# Altium schematic sheet 19-CPLD.SchDoc
size A4
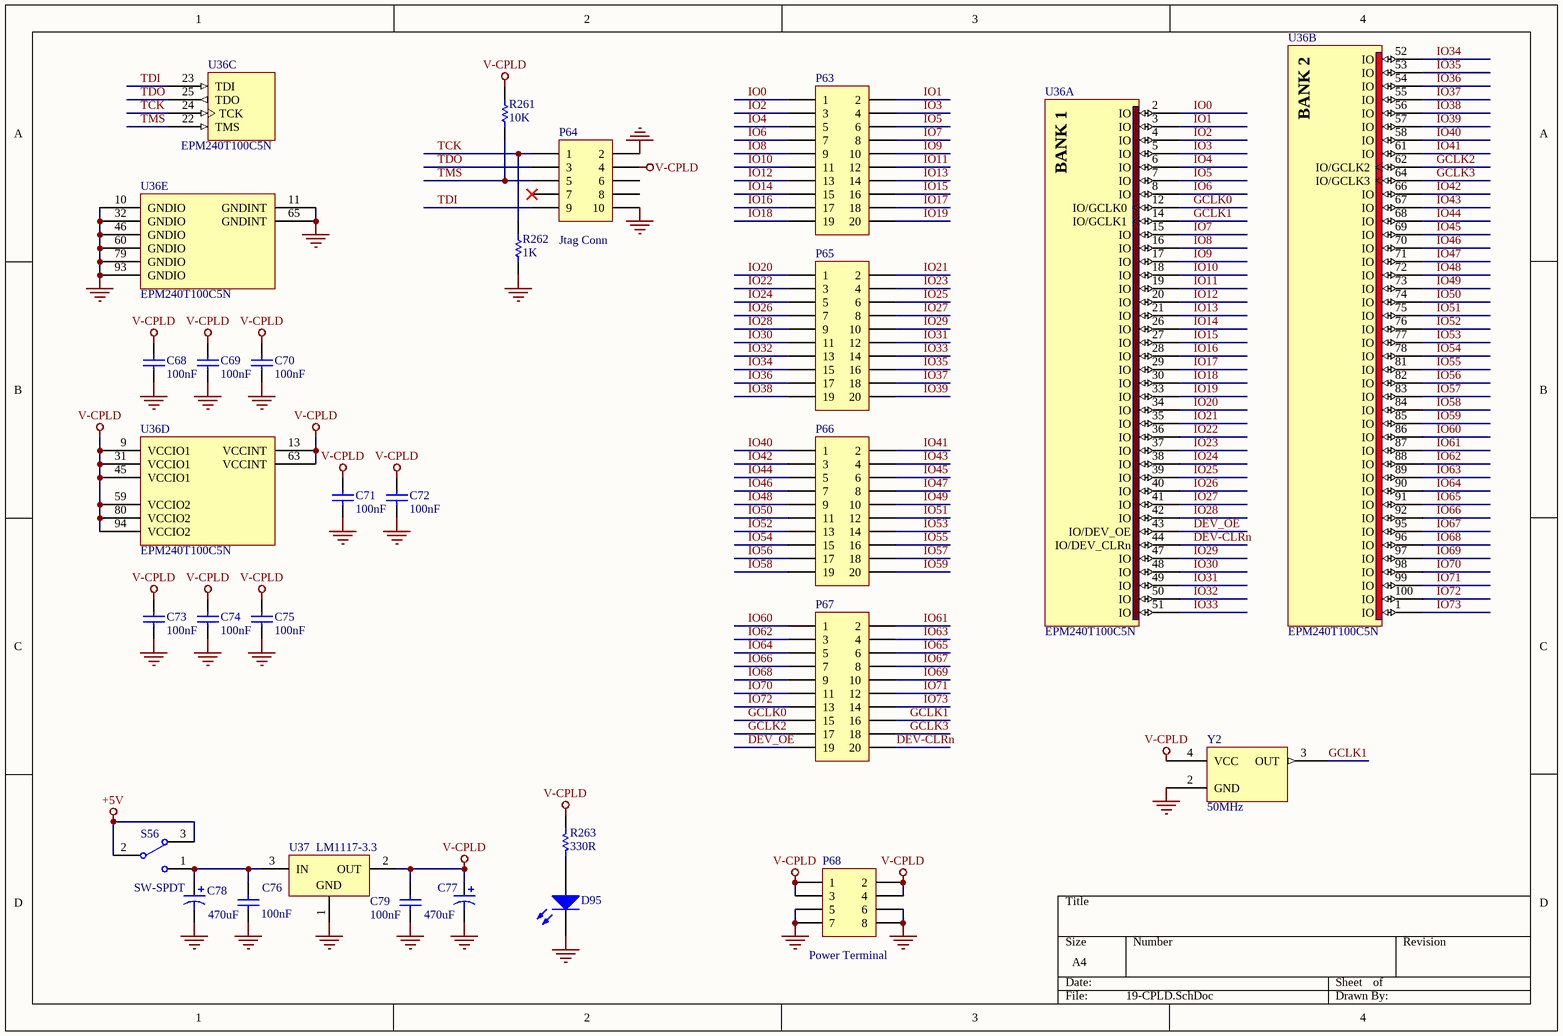
[diagram p0: 19-CPLD.SchDoc]

## Parts
C68  value 100nF  [c-0805]  (hidden comment: 104)
C69  value 100nF  [c-0805]  (hidden comment: 104)
C70  value 100nF  [c-0805]  (hidden comment: 104)
C71  value 100nF  [c-0805]  (hidden comment: 104)
C72  value 100nF  [c-0805]  (hidden comment: 104)
C73  value 100nF  [c-0805]  (hidden comment: 104)
C74  value 100nF  [c-0805]  (hidden comment: 104)
C75  value 100nF  [c-0805]  (hidden comment: 104)
C76  value 100nF  [c-0805]  (hidden comment: 104)
C77  value 470uF  [C-ALU-10x10mm]  (hidden comment: 470uF/16V)
C78  value 470uF  [C-ALU-10x10mm]  (hidden comment: 470uF/16V)
C79  value 100nF  [c-0805]  (hidden comment: 104)
D95  LED  [LED-3528]  (value not drawn)
P63  H2  [HDR2X10]  (value not drawn)
P64  value Jtag Conn  [HDR2X5]  (hidden comment: IDE5x2)
P65  H2  [HDR2X10]  (value not drawn)
P66  H2  [HDR2X10]  (value not drawn)
P67  H2  [HDR2X10]  (value not drawn)
P68  Publisher: Power Terminal  [HDR2X4]  (hidden comment: Header 4X2)
R261  10K  [r-0805]
R262  1K  [r-0805]
R263  value 330R  [r-0805]  (hidden comment: 331)
S56  SW-SPDT  [SW-DIP1SMD]
U36  EPM240T100C5N  [TQFP100L]  (parts A,B,C,D,E of 5)
U37  LM1117-3.3  [sot223]
Y2  50MHz  [xt5032]

## Nets
+5V: S56.2 S56.3
GND: C68.2 C69.2 C70.2 C71.2 C72.2 C73.2 C74.2 C75.2 C76.1 C77.2 C78.2 C79.1 D95.2(K) P64.2 P64.10 P68.5 P68.6 P68.7 P68.8 R262.2 U36.10(GNDIO) U36.11(GNDINT) U36.32(GNDIO) U36.46(GNDIO) U36.60(GNDIO) U36.65(GNDINT) U36.79(GNDIO) U36.93(GNDIO) U37.1(GND) Y2.2(GND)
V-CPLD: C68.1 C69.1 C70.1 C71.1 C72.1 C73.1 C74.1 C75.1 C77.1 C79.2 P64.4 P68.1 P68.2 P68.3 P68.4 R261.1 R263.1 U36.9(VCCIO1) U36.13(VCCINT) U36.31(VCCIO1) U36.45(VCCIO1) U36.59(VCCIO2) U36.63(VCCINT) U36.80(VCCIO2) U36.94(VCCIO2) U37.2(OUT) Y2.4(VCC)
DEV-CLRn: P67.20 U36.44(IO/DEV_CLRn)
DEV_OE: P67.19 U36.43(IO/DEV_OE)
GCLK0: P67.15 U36.12(IO/GCLK0)
GCLK1: P67.16 U36.14(IO/GCLK1) Y2.3(OUT)
GCLK2: P67.17 U36.62(IO/GCLK2)
GCLK3: P67.18 U36.64(IO/GCLK3)
IO0: P63.1 U36.2(IO)
IO1: P63.2 U36.3(IO)
IO2: P63.3 U36.4(IO)
IO3: P63.4 U36.5(IO)
IO4: P63.5 U36.6(IO)
IO5: P63.6 U36.7(IO)
IO6: P63.7 U36.8(IO)
IO7: P63.8 U36.15(IO)
IO8: P63.9 U36.16(IO)
IO9: P63.10 U36.17(IO)
IO10: P63.11 U36.18(IO)
IO11: P63.12 U36.19(IO)
IO12: P63.13 U36.20(IO)
IO13: P63.14 U36.21(IO)
IO14: P63.15 U36.26(IO)
IO15: P63.16 U36.27(IO)
IO16: P63.17 U36.28(IO)
IO17: P63.18 U36.29(IO)
IO18: P63.19 U36.30(IO)
IO19: P63.20 U36.33(IO)
IO20: P65.1 U36.34(IO)
IO21: P65.2 U36.35(IO)
IO22: P65.3 U36.36(IO)
IO23: P65.4 U36.37(IO)
IO24: P65.5 U36.38(IO)
IO25: P65.6 U36.39(IO)
IO26: P65.7 U36.40(IO)
IO27: P65.8 U36.41(IO)
IO28: P65.9 U36.42(IO)
IO29: P65.10 U36.47(IO)
IO30: P65.11 U36.48(IO)
IO31: P65.12 U36.49(IO)
IO32: P65.13 U36.50(IO)
IO33: P65.14 U36.51(IO)
IO34: P65.15 U36.52(IO)
IO35: P65.16 U36.53(IO)
IO36: P65.17 U36.54(IO)
IO37: P65.18 U36.55(IO)
IO38: P65.19 U36.56(IO)
IO39: P65.20 U36.57(IO)
IO40: P66.1 U36.58(IO)
IO41: P66.2 U36.61(IO)
IO42: P66.3 U36.66(IO)
IO43: P66.4 U36.67(IO)
IO44: P66.5 U36.68(IO)
IO45: P66.6 U36.69(IO)
IO46: P66.7 U36.70(IO)
IO47: P66.8 U36.71(IO)
IO48: P66.9 U36.72(IO)
IO49: P66.10 U36.73(IO)
IO50: P66.11 U36.74(IO)
IO51: P66.12 U36.75(IO)
IO52: P66.13 U36.76(IO)
IO53: P66.14 U36.77(IO)
IO54: P66.15 U36.78(IO)
IO55: P66.16 U36.81(IO)
IO56: P66.17 U36.82(IO)
IO57: P66.18 U36.83(IO)
IO58: P66.19 U36.84(IO)
IO59: P66.20 U36.85(IO)
IO60: P67.1 U36.86(IO)
IO61: P67.2 U36.87(IO)
IO62: P67.3 U36.88(IO)
IO63: P67.4 U36.89(IO)
IO64: P67.5 U36.90(IO)
IO65: P67.6 U36.91(IO)
IO66: P67.7 U36.92(IO)
IO67: P67.8 U36.95(IO)
IO68: P67.9 U36.96(IO)
IO69: P67.10 U36.97(IO)
IO70: P67.11 U36.98(IO)
IO71: P67.12 U36.99(IO)
IO72: P67.13 U36.100(IO)
IO73: P67.14 U36.1(IO)
TCK: P64.1 R262.1 U36.24(TCK)
TDI: P64.9 U36.23(TDI)
TDO: P64.3 U36.25(TDO)
TMS: P64.5 R261.2 U36.22(TMS)
NetC76_2: C76.2 C78.1 S56.1 U37.3(IN)
NetD95_1: D95.1(A) R263.2

Not connected (* = marked no-connect by the designer): P64 6 7* 8; Y2 1(NC)

## Notes on the sheet
- (in symbol EPM240T100C5N, part A) BANK 1
- (in symbol EPM240T100C5N, part B) BANK 2

## Library data of the parts
C68-C75 = Cap: Capacitor; Published: 8-Jun-2000; LatestRevisionDate: 17-Jul-2002; LatestRevisionNote: Re-released for DXP Platform.; PackageReference: RAD-0.3; Publisher: Altium Limited; PackageDescription: Radial Cap, Thru-Hole; 2 Leads; 0.3 in Pin Spacing
C76 C79 = Cap: Capacitor; Manufacturer: Generic Components; Class: Passive; Published: 08/06/2000; Publisher: Altium Hobart Technology Centre; SubClass: Capacitor
C77 C78 = Cap Pol1: Polarized Capacitor (Radial); Published: 8-Jun-2000; LatestRevisionDate: 17-Jul-2002; LatestRevisionNote: Re-released for DXP Platform.; PackageReference: RB7.6-15; Publisher: Altium Limited
D95 = LED0: Typical INFRARED GaAs LED; Published: 8-Jun-2000; LatestRevisionDate: 08-Jul-2005; LatestRevisionNote: Mech Layer 1 removed.; PackageReference: LED-0; Publisher: Altium Limited; Value: LED
P63 P65-P67 = Header 10X2: Header, 10-Pin, Dual row; Value: IO; LatestRevisionDate: 17-Jul-2002; LatestRevisionNote: Re-released for DXP Platform.
P64 = Header 5X2: Header, 5-Pin, Dual row; LatestRevisionDate: 17-Jul-2002; LatestRevisionNote: Re-released for DXP Platform.
P68 = Header 4X2: Header, 4-Pin, Dual row; LatestRevisionDate: 17-Jul-2002; LatestRevisionNote: Re-released for DXP Platform.
R261-R263 = Res1: Resistor; Published: 8-Jun-2000; LatestRevisionDate: 17-Jul-2002; LatestRevisionNote: Re-released for DXP Platform.; PackageReference: AXIAL-0.3; Publisher: Altium Limited
  R261: Value: 10K
  R262: Value: 1K
S56 = SW-SPDT: SPDT Subminiature Toggle Switch, Right Angle Mounting, Vertical Actuation; Published: 24-Mar-1999; LatestRevisionDate: 17-Dec-2003; LatestRevisionNote: Schematic revised, PCB Footprint replaced.; DatasheetVersion: 05-Dec-2000; PackageReference: TL36WW15050; Publisher: Altium Limited; PackageDescription: Switch; 4 Leads; ComponentLink1Description: Manufacturer Link; ComponentLink1URL: http://www.apem.com
U36 = EPM240T100C5N: MAX II 3.3/2.5V CPLD, 80 IOs, 240 Logic Elements, 100-Pin Plastic TQFP, Commercial Temperature, Speed Grade 5, Pb-Free; Note: Each set of VCCIO pins can be connected to 3.3V, 2.5V, 1.8V, or 1.5V.; Note: All VCCINT pins must be connected to either 3.3V or 2.5V (but not a combination of both).; Published: 4-Mar-2005; LatestRevisionDate: 13-Apr-2006; LatestRevisionNote: IPC-7351 Footprint Added.; DatasheetVersion: ver1.8, Jul-2006; PackageVersion: ver15.1, May-2008; PackageReference: TQFP100; Publisher: Altium Limited; PackageDescription: 100-Pin Plastic Thin Quad Flat Pack (TQFP100) - Wire Bond; Supplier 1: Digi-Key; Supplier Part Number 1: 544-1964-ND; Supplier 2: Farnell; Supplier Part Number 2: 1662268; Supplier 3: Farnell; Supplier Part Number 3: 1453503; Code_JEDEC: MS-026-AED; ComponentLink1Description: Manufacturer Link; ComponentLink1URL: http://www.altera.com/products/devices/cpld/max2/mx2-index.jsp; ComponentLink2Description: Handbook; ComponentLink2URL: http://www.altera.com/literature/hb/max2/max2_mii5v1.pdf; ComponentLink3Description: Packaging Specification; ComponentLink3URL: http://www.altera.com/literature/ds/dspkg.pdf
U37 = LM1117IDTX-3.3: 800mA Low-Dropout Linear Regulator, 3-pin TO-252; Manufacturer: National Semiconductor; PackageTopMarking: NSUZXYTT*LM1117*IDT-3.3; PowerWise: N; CompType: LDO IC; Published: 1-Mar-2010; DatasheetVersion: Apr-2006; PackageVersion: revD, Feb-2009; PackageReference: TD03B; Publisher: Altium Limited; PackageDescription: TO252, Molded, Jedec, 6.8 x 6.10 x 2.30mm Body, 3 Lead, 2.28mm Pitch, Surface Mount; PartNumber: LM1117IDTX-3.3; Value: LM1117-3.3; PinCount: 3; Code_JEDEC: TO-252-AA; ComponentLink1Description: LM1117 Datasheet; ComponentLink1URL: http://www.national.com/ds/LM/LM1117.pdf; ComponentLink2Description: LM1117 Web Page; ComponentLink2URL: http://www.national.com/pf/LM/LM1117.html; ComponentLink3Description: TD03B Package Page; ComponentLink3URL: http://www.national.com/packaging/folders/td03b.html
Y2 = OSC: XTAL 50MHz, 4pin; Value: 50MHz